# EAGLE design 68008 (EAGLE 7.2.0)
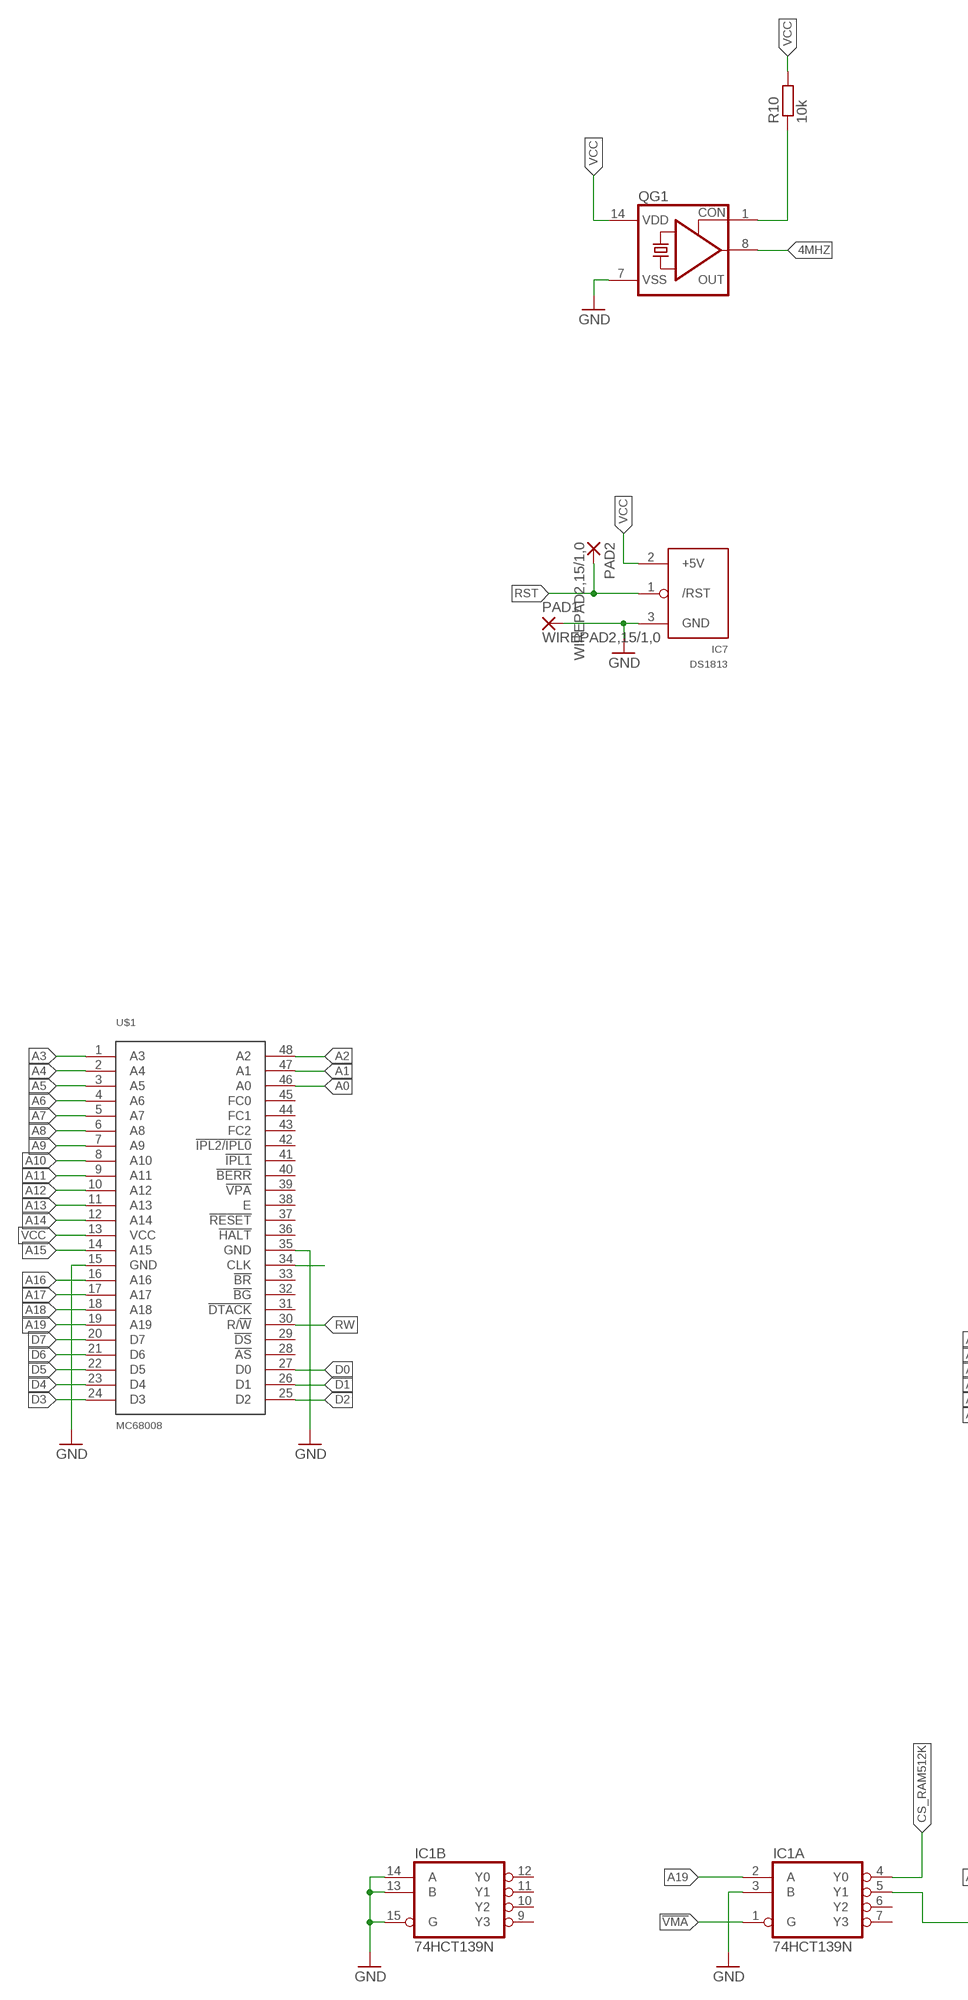
[diagram p0: schematic, sheet 1, part 1 of 2]
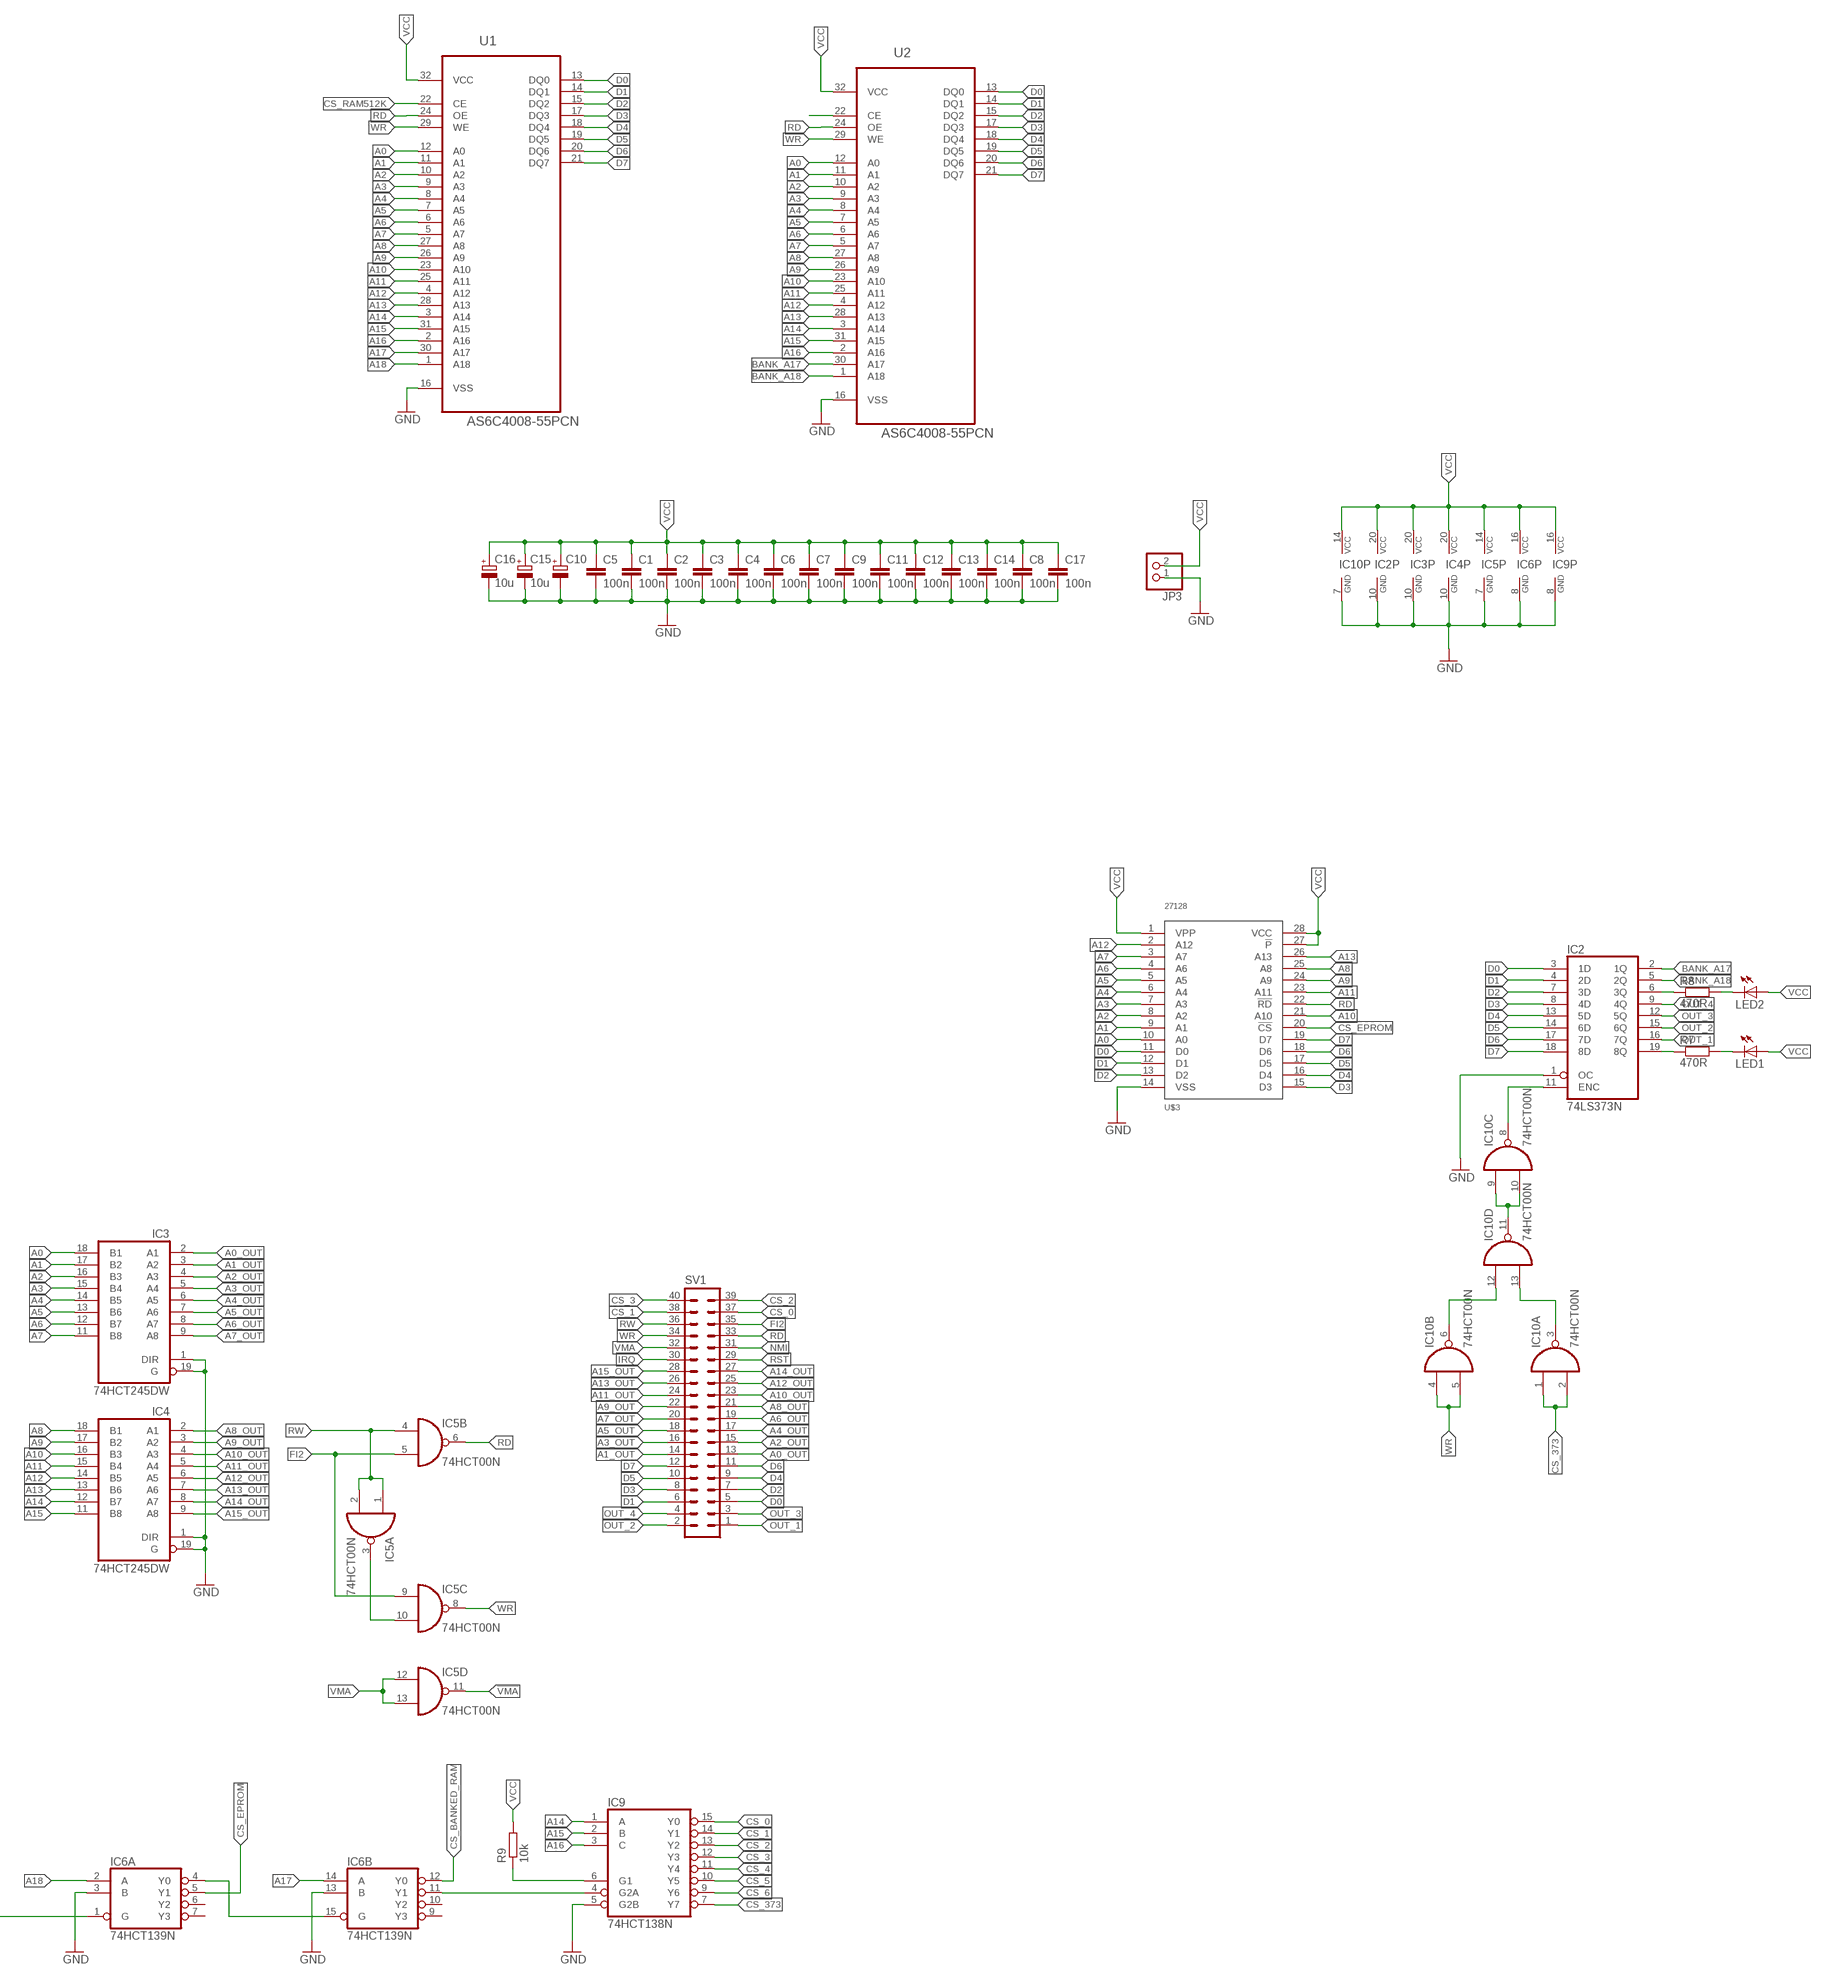
[diagram p1: schematic, sheet 1, part 2 of 2]

## Parts
C1  100n  C-EUC1206  [C1206]
C2  100n  C-EUC1206  [C1206]
C3  100n  C-EUC1206  [C1206]
C4  100n  C-EUC1206  [C1206]
C5  100n  C-EUC0603  [C0603]
C6  100n  C-EUC1206  [C1206]
C7  100n  C-EUC0603  [C0603]
C8  100n  C-EUC1206  [C1206]
C9  100n  C-EUC1206  [C1206]
C10  CPOL-EUE5-10.5  [E5-10,5]
C11  100n  C-EUC0805  [C0805]
C12  100n  C-EUC0805  [C0805]
C13  100n  C-EUC0805  [C0805]
C14  100n  C-EUC0603  [C0603]
C15  10u  CPOL-EUSMCB  [SMC_B]
C16  10u  CPOL-EUSMCB  [SMC_B]
C17  100n  C-EUC0805  [C0805]
IC1  74HCT139N  [DIL16]
IC2  74LS373N  [DIL20]
IC3  74HCT245DW  [SO20W]
IC4  74HCT245DW  [SO20W]
IC5  74HCT00N  [DIL14]
IC6  74HCT139N  [DIL16]
IC7  DS1813  [TO-92]
IC9  74HCT138N  [DIL16]
IC10  74HCT00N  [DIL14]
JP3  PINHD-1X2/90  [1X02/90]
LED1  LED5MM  [LED5MM]
LED2  LED5MM  [LED5MM]
PAD1  WIREPAD2,15/1,0  [2,15/1,0]
PAD2  WIREPAD2,15/1,0  [2,15/1,0]
QG1  CRYSTAL_RES-SG51  [SG51]
R7  470R  R-EU_R1206  [R1206]
R8  470R  R-EU_R1206  [R1206]
R9  10k  R-EU_R1206  [R1206]
R10  10k  R-EU_R1206  [R1206]
SV1  ML40L  [ML40L]
U1  AS6C4008-55PCN  [DIP254P1524X393-32]
U2  AS6C4008-55PCN  [DIP254P1524X393-32]
U$1  MC68008  [DIL48]
U$3  27128  [DIL28]

## Nets
4MHZ: QG1.8(OUT)
!VMA: IC1.1(A:G) IC5.11(D:O)
A0: IC3.18(B1) U1.12(A0) U2.12(A0) U$1.46(A0) U$3.10(A0)
A0_OUT: IC3.2(A1) SV1.13
A1: IC3.17(B2) U1.11(A1) U2.11(A1) U$1.47(A1) U$3.9(A1)
A1_OUT: IC3.3(A2) SV1.14
A2: IC3.16(B3) U1.10(A2) U2.10(A2) U$1.48(A2) U$3.8(A2)
A2_OUT: IC3.4(A3) SV1.15
A3: IC3.15(B4) U1.9(A3) U2.9(A3) U$1.1(A3) U$3.7(A3)
A3_OUT: IC3.5(A4) SV1.16
A4: IC3.14(B5) U1.8(A4) U2.8(A4) U$1.2(A4) U$3.6(A4)
A4_OUT: IC3.6(A5) SV1.17
A5: IC3.13(B6) U1.7(A5) U2.7(A5) U$1.3(A5) U$3.5(A5)
A5_OUT: IC3.7(A6) SV1.18
A6: IC3.12(B7) U1.6(A6) U2.6(A6) U$1.4(A6) U$3.4(A6)
A6_OUT: IC3.8(A7) SV1.19
A7: IC3.11(B8) U1.5(A7) U2.5(A7) U$1.5(A7) U$3.3(A7)
A7_OUT: IC3.9(A8) SV1.20
A8: IC4.18(B1) U1.27(A8) U2.27(A8) U$1.6(A8) U$3.25(A8)
A8_OUT: IC4.2(A1) SV1.21
A9: IC4.17(B2) U1.26(A9) U2.26(A9) U$1.7(A9) U$3.24(A9)
A9_OUT: IC4.3(A2) SV1.22
A10: IC4.16(B3) U1.23(A10) U2.23(A10) U$1.8(A10) U$3.21(A10)
A10_OUT: IC4.4(A3) SV1.23
A11: IC4.15(B4) U1.25(A11) U2.25(A11) U$1.9(A11) U$3.23(A11)
A11_OUT: IC4.5(A4) SV1.24
A12: IC4.14(B5) U1.4(A12) U2.4(A12) U$1.10(A12) U$3.2(A12)
A12_OUT: IC4.6(A5) SV1.25
A13: IC4.13(B6) U1.28(A13) U2.28(A13) U$1.11(A13) U$3.26(A13)
A13_OUT: IC4.7(A6) SV1.26
A14: IC4.12(B7) IC9.1(A) U1.3(A14) U2.3(A14) U$1.12(A14)
A14_OUT: IC4.8(A7) SV1.27
A15: IC4.11(B8) IC9.2(B) U1.31(A15) U2.31(A15) U$1.14(A15)
A15_OUT: IC4.9(A8) SV1.28
A16: IC9.3(C) U1.2(A16) U2.2(A16) U$1.16(A16)
A17: IC6.14(B:A) U1.30(A17) U$1.17(A17)
A18: IC6.2(A:A) U1.1(A18) U$1.18(A18)
A19: IC1.2(A:A) U$1.19(A19)
BANK_A17: IC2.2(1Q) U2.30(A17)
BANK_A18: IC2.5(2Q) U2.1(A18)
CLK: U$1.34(CLK)
CS_0: IC9.15(Y0) SV1.37
CS_1: IC9.14(Y1) SV1.38
CS_2: IC9.13(Y2) SV1.39
CS_3: IC9.12(Y3) SV1.40
CS_4: IC9.11(Y4)
CS_5: IC9.10(Y5)
CS_6: IC9.9(Y6)
CS_373: IC9.7(Y7) IC10.1(A:I0) IC10.2(A:I1)
CS_BANKED_RAM: IC6.12(B:Y0) U2.22(CE)
CS_EPROM: IC6.5(A:Y1) U$3.20(!CS)
CS_RAM512K: IC1.4(A:Y0) U1.22(CE)
D0: IC2.3(1D) SV1.5 U1.13(DQ0) U2.13(DQ0) U$1.27(D0) U$3.11(D0)
D1: IC2.4(2D) SV1.6 U1.14(DQ1) U2.14(DQ1) U$1.26(D1) U$3.12(D1)
D2: IC2.7(3D) SV1.7 U1.15(DQ2) U2.15(DQ2) U$1.25(D2) U$3.13(D2)
D3: IC2.8(4D) SV1.8 U1.17(DQ3) U2.17(DQ3) U$1.24(D3) U$3.15(D3)
D4: IC2.13(5D) SV1.9 U1.18(DQ4) U2.18(DQ4) U$1.23(D4) U$3.16(D4)
D5: IC2.14(6D) SV1.10 U1.19(DQ5) U2.19(DQ5) U$1.22(D5) U$3.17(D5)
D6: IC2.17(7D) SV1.11 U1.20(DQ6) U2.20(DQ6) U$1.21(D6) U$3.18(D6)
D7: IC2.18(8D) SV1.12 U1.21(DQ7) U2.21(DQ7) U$1.20(D7) U$3.19(D7)
FI2: IC5.5(B:I1) IC5.9(C:I0) SV1.35
GND: C1.2 C2.2 C3.2 C4.2 C5.2 C6.2 C7.2 C8.2 C9.2 C10.- C11.2 C12.2 C13.2 C14.2 C15.- C16.- C17.2 IC1.3(A:B) IC1.13(B:B) IC1.14(B:A) IC1.15(B:G) IC2.1(OC) IC2.10(GND) IC3.1(DIR) IC3.10(GND) IC3.19(G) IC4.1(DIR) IC4.10(GND) IC4.19(G) IC5.7(P:GND) IC6.3(A:B) IC6.8(P:GND) IC6.13(B:B) IC7.3(GND) IC9.5(G2B) IC9.8(GND) IC10.7(P:GND) JP3.1 PAD1.1(P) QG1.7(VSS) U1.16(VSS) U2.16(VSS) U$1.15(GND) U$1.35(GND) U$3.14(VSS)
IRQ: SV1.30
N$1: IC1.5(A:Y1) IC6.1(A:G)
N$3: IC2.19(8Q) R7.1
N$4: LED1.K(C) R7.2
N$7: QG1.1(CON) R10.1
N$11: IC2.11(ENC) IC10.8(C:O)
N$12: IC10.9(C:I0) IC10.10(C:I1) IC10.11(D:O)
N$13: IC10.3(A:O) IC10.13(D:I1)
N$14: IC10.6(B:O) IC10.12(D:I0)
N$15: IC2.6(3Q) R8.1
N$17: LED2.K(C) R8.2
N$18: IC5.3(A:O) IC5.10(C:I1)
N$19: IC6.4(A:Y0) IC6.15(B:G)
N$20: IC9.6(G1) R9.1
N$21: IC6.11(B:Y1) IC9.4(G2A)
NMI: SV1.31
OUT_1: IC2.16(7Q) SV1.1
OUT_2: IC2.15(6Q) SV1.2
OUT_3: IC2.12(5Q) SV1.3
OUT_4: IC2.9(4Q) SV1.4
RD: IC5.6(B:O) SV1.33 U1.24(OE) U2.24(OE) U$3.22(!RD)
RST: IC7.1(/RST) PAD2.1(P) SV1.29
RW: IC5.1(A:I0) IC5.2(A:I1) IC5.4(B:I0) SV1.36 U$1.30(R/!W)
VCC: C1.1 C2.1 C3.1 C4.1 C5.1 C6.1 C7.1 C8.1 C9.1 C10.+ C11.1 C12.1 C13.1 C14.1 C15.+ C16.+ C17.1 IC2.20(VCC) IC3.20(VCC) IC4.20(VCC) IC5.14(P:VCC) IC6.16(P:VCC) IC7.2(+5V) IC9.16(VCC) IC10.14(P:VCC) JP3.2 LED1.A LED2.A QG1.14(VDD) R9.2 R10.2 U1.32(VCC) U2.32(VCC) U$1.13(VCC) U$3.1(VPP) U$3.27(!P) U$3.28(VCC)
VMA: IC5.12(D:I0) IC5.13(D:I1) SV1.32
WR: IC5.8(C:O) IC10.4(B:I0) IC10.5(B:I1) SV1.34 U1.29(WE) U2.29(WE)
Unconnected: IC1.6(A:Y2) IC1.7(A:Y3) IC1.9(B:Y3) IC1.10(B:Y2) IC1.11(B:Y1) IC1.12(B:Y0) IC6.6(A:Y2) IC6.7(A:Y3) IC6.9(B:Y3) IC6.10(B:Y2) U$1.28(!AS) U$1.29(!DS) U$1.31(!DTACK) U$1.32(!BG) U$1.33(!BR) U$1.36(!HALT) U$1.37(!RESET) U$1.38(E) U$1.39(!VPA) U$1.40(!BERR) U$1.41(!IPL1) U$1.42(!IPL2/IPL0) U$1.43(FC2) U$1.44(FC1) U$1.45(FC0)

## Power pins joined to a net without a drawn wire
GND: IC1.8(P:GND)
VCC: IC1.16(P:VCC)

## Library data of the parts
C1-C9 C11-C14 C17 = rcl:C-EU: CAPACITOR, European symbol
C10 C15 C16 = rcl:CPOL-EU: POLARIZED CAPACITOR, European symbol
IC1 IC6 = 74xx-eu:74*139: Dual 2-line to 4-line DECODER/DEMULTIPLEXER
IC2 = 74xx-eu:74*373: Octal D type transparent LATCH, edge triggered
IC3 IC4 = 74xx-eu:74*245: Octal BUS TRANSCEIVER, 3-state
IC5 IC10 = 74xx-eu:74*00: Quad 2-input NAND gate
IC7 = ds1813_revised:DS1813
IC9 = 74xx-eu:74*138: 3-line to 8-line DECODER/DEMULTIPLEXER
JP3 = pinhead:PINHD-1X2: PIN HEADER
LED1 LED2 = led:LED: LED OSRAM: - CHIPLED LG R971, LG N971, LY N971, LG Q971, LY Q971, LO R971, LY R971 LH N974, LH R974 LS Q976, LO Q976, LY Q976 LO Q996 - Hyper CHIPLED LW Q18S LB Q993, LB Q99A, LB R99A - SideLED LS A670, LO A670, LY A670, LG A670, LP A670 LB A673, LV A673, LT A673, LW A673 LH A674 LY A675 LS A676, LA A676, LO A676, LY A676, LW A676 LS A679, LY A679, LG A679 - Hyper Micro SIDELED® LS Y876, LA Y876, LO Y876, LY Y876 LT Y87S - SmartLED LW L88C, LW L88S LB L89C, LB L89S, LG L890 LS L89K, LO L89K, LY L89K LS L896, LA L896, LO L896, LY L896 - TOPLED LS T670, LO T670, LY T670, LG T670, LP T670 LSG T670, LSP T670, LSY T670, LOP T670, LYG T670 LG T671, LOG T671, LSG T671 LB T673, LV T673, LT T673, LW T673 LH T674 LS T676, LA T676, LO T676, LY T676, LB T676, LH T676, LSB T676, LW T676 LB T67C, LV T67C, LT T67C, LS T67K, LO T67K, LY T67K, LW E67C LS E67B, LA E67B, LO E67B, LY E67B, LB E67C, LV E67C, LT E67C LW T67C LS T679, LY T679, LG T679 LS T770, LO T770, LY T770, LG T770, LP T770 LB T773, LV T773, LT T773, LW T773 LH T774 LS E675, LA E675, LY E675, LS T675 LS T776, LA T776, LO T776, LY T776, LB T776 LHGB T686 LT T68C, LB T68C - Hyper Mini TOPLED® LB M676 - Mini TOPLED Santana® LG M470 LS M47K, LO M47K, LY M47K Source: http://www.osram.convergy.de LUXEON: - LUMILED® LXK2-PW12-R00, LXK2-PW12-S00, LXK2-PW14-U00, LXK2-PW14-V00 LXK2-PM12-R00, LXK2-PM12-S00, LXK2-PM14-U00 LXK2-PE12-Q00, LXK2-PE12-R00, LXK2-PE12-S00, LXK2-PE14-T00, LXK2-PE14-U00 LXK2-PB12-K00, LXK2-PB12-L00, LXK2-PB12-M00, LXK2-PB14-N00, LXK2-PB14-P00, LXK2-PB14-Q00 LXK2-PR12-L00, LXK2-PR12-M00, LXK2-PR14-Q00, LXK2-PR14-R00 LXK2-PD12-Q00, LXK2-PD12-R00, LXK2-PD12-S00 LXK2-PH12-R00, LXK2-PH12-S00 LXK2-PL12-P00, LXK2-PL12-Q00, LXK2-PL12-R00 Source: www.luxeon.com KINGBRIGHT: KA-3528ASYC Source: www.kingbright.com
PAD1 PAD2 = wirepad:WIREPAD: Wire PAD connect wire on PCB
QG1 = crystal:CRYSTAL_RES-: CRYSTAL RESONATOR; OC_FARNELL: unknown; OC_NEWARK: unknown
R7-R10 = rcl:R-EU_: RESISTOR, European symbol
SV1 = con-harting-ml:ML40: HARTING; OC_FARNELL: unknown; OC_NEWARK: unknown
U1 U2 = Alliance_Memory_By_element14_Batch_1:AS6C4008-55PCN: CMOS SRAM; MPN: AS6C4008-55PCN; OC_FARNELL: 1562900; OC_NEWARK: 94M6217; PACKAGE: DIP-32; SUPPLIER: ALLIANCE MEMORY
U$1 = mw:MC68008
U$3 = mw:27128

## Board
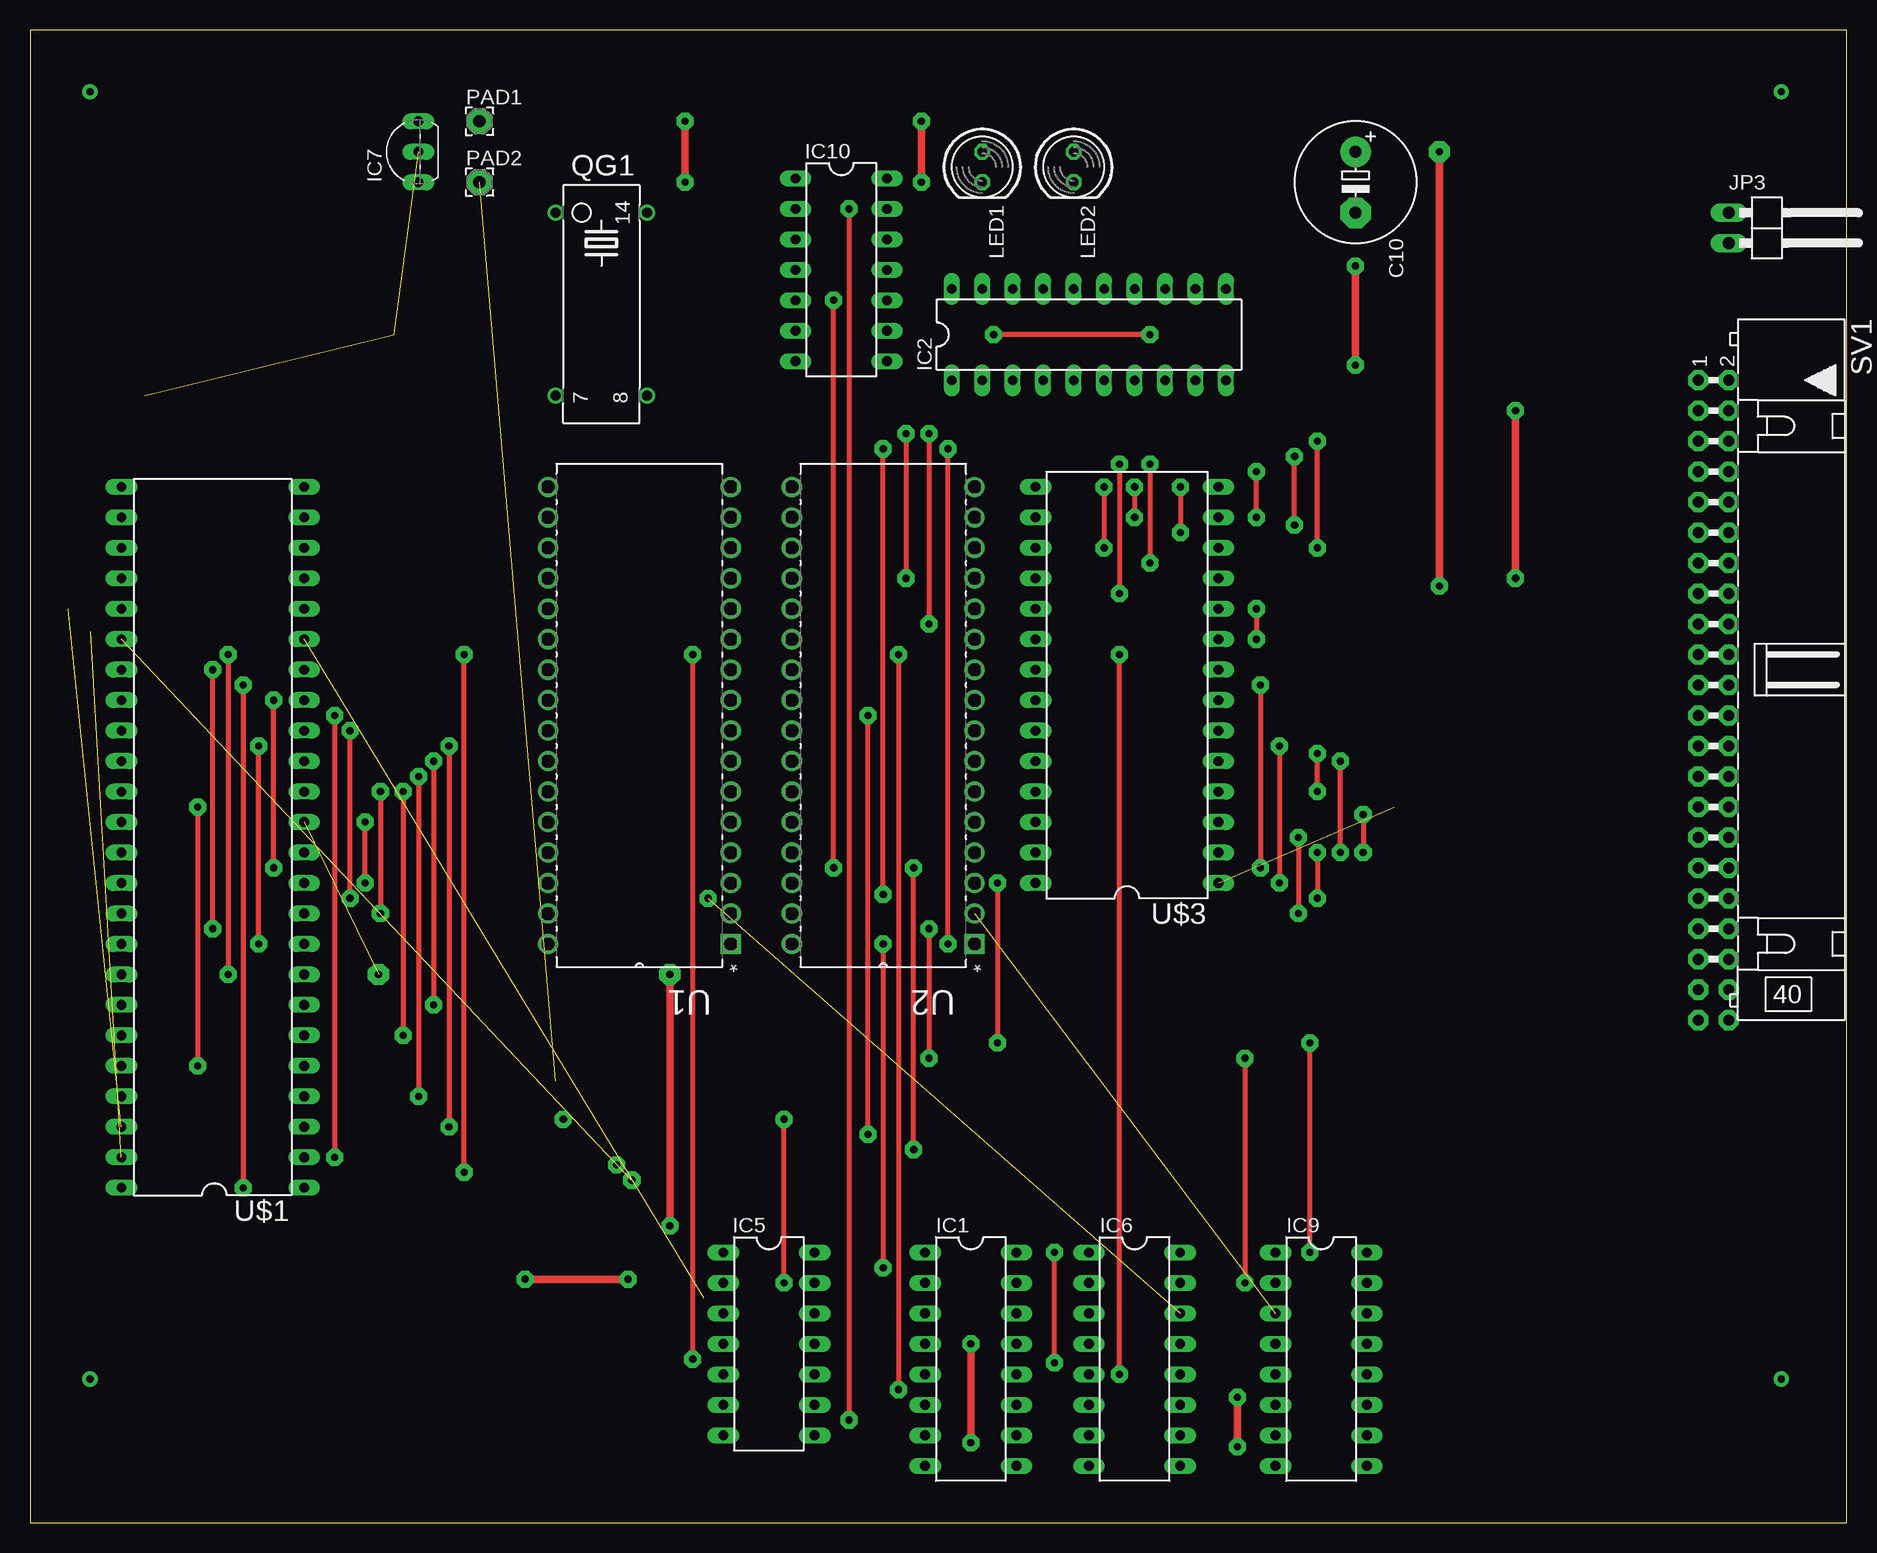
[diagram p2: board, top side]
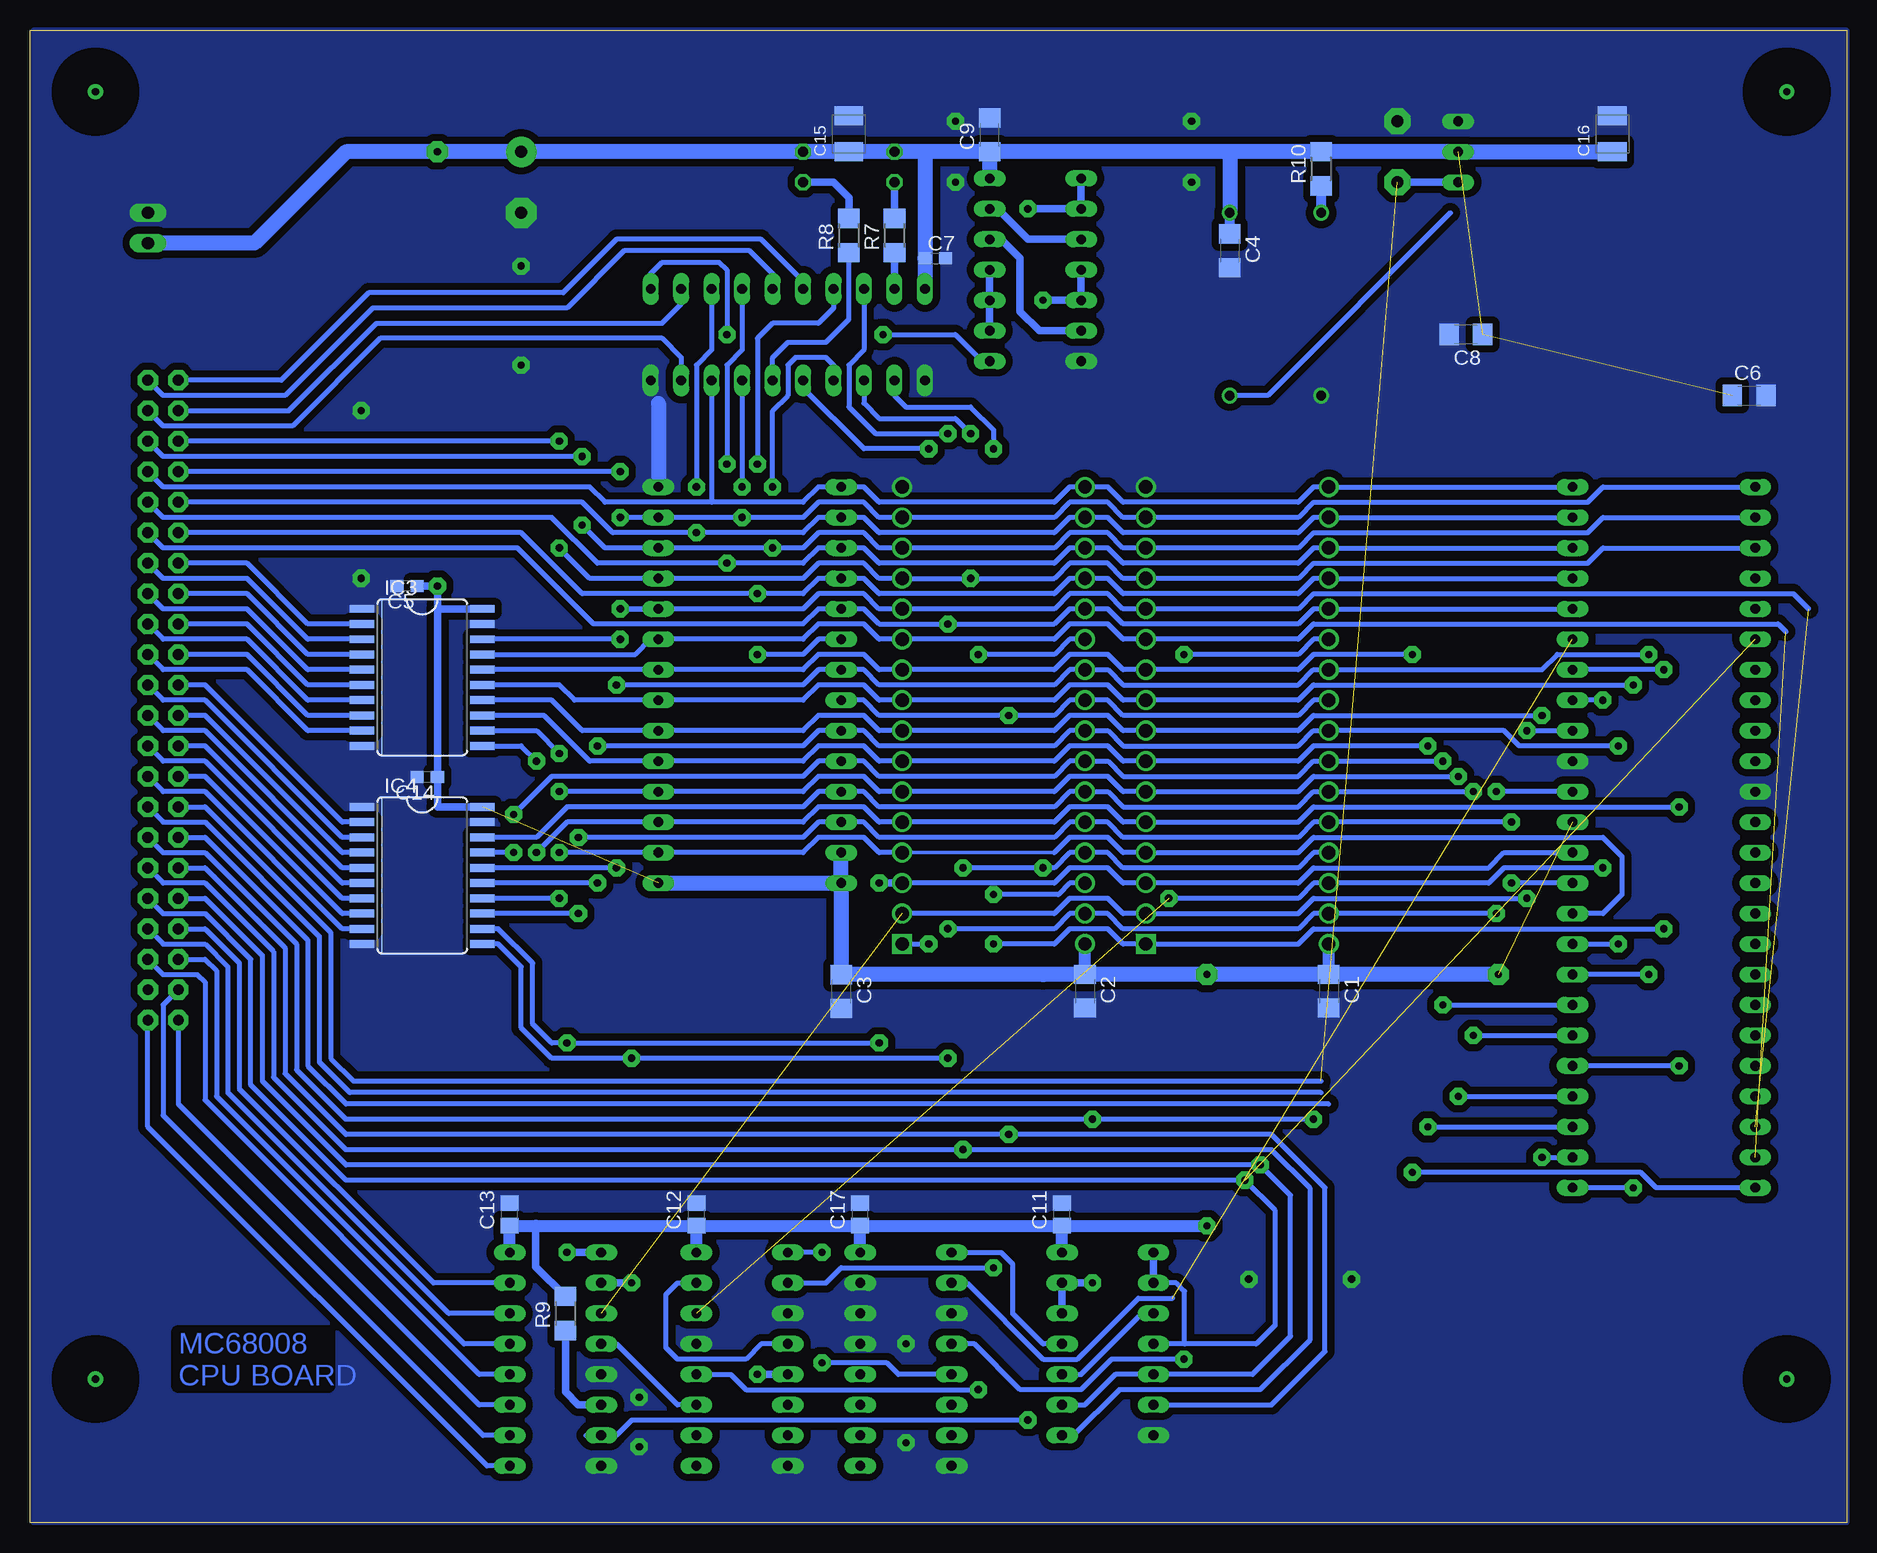
[diagram p3: board, bottom side, seen from below]

Size 151.44 x 124.45 mm. Coordinates in mm from the lower left corner, seen from the top.
Outline: 0,0 151.44,0 151.44,124.45 0,124.45 0,0
Copper layers (1*16): Top 0.035mm / dielectric 1.5mm / Bottom 0.035mm
Design rules "default *": minimum track width 10mil, minimum drill 24mil, track to track 8mil, track to pad 8mil, pad to pad 8mil, via to via 8mil, smd to smd 8mil, copper to edge 0mil, drill to drill 8mil, minimum pad ring 10mil, minimum via ring 8mil, stop-mask expansion 4mil, vias tented up to drill 0mil, thermal gap 10mil
bRestrict: area 2,8.9 to 8,15; area 2,116.3 to 8,122.3; area 142.9,8.9 to 149,15; area 142.9,116.3 to 149,122.3

### Footprints (pad centres in the part's own frame; a part is rotated, then mirrored left to right if it is on the bottom)
C1206 = smd 1.6 x 1.8: 1 -1.4,0; 2 1.4,0
C0603 = smd 1.1 x 1: 1 -0.85,0; 2 0.85,0
E5-10,5 = drill 1.016 pad 2.54: + -2.54,0 | drill 1.016 pad 2.54 octagon: - 2.54,0
C0805 = smd 1.3 x 1.5: 1 -0.95,0; 2 0.95,0
SMC_B = smd 1.6 x 2.4: + -1.5,0; - 1.5,0
DIL16 = drill 0.813 long: 1 -8.89,-3.81; 2 -6.35,-3.81; 3 -3.81,-3.81; 4 -1.27,-3.81; 5 1.27,-3.81; 6 3.81,-3.81; 7 6.35,-3.81; 8 8.89,-3.81; 9 8.89,3.81; 10 6.35,3.81; 11 3.81,3.81; 12 1.27,3.81; 13 -1.27,3.81; 14 -3.81,3.81; 15 -6.35,3.81; 16 -8.89,3.81
DIL20 = drill 0.813 long: 1 -11.43,-3.81; 2 -8.89,-3.81; 3 -6.35,-3.81; 4 -3.81,-3.81; 5 -1.27,-3.81; 6 1.27,-3.81; 7 3.81,-3.81; 8 6.35,-3.81; 9 8.89,-3.81; 10 11.43,-3.81; 11 11.43,3.81; 12 8.89,3.81; 13 6.35,3.81; 14 3.81,3.81; 15 1.27,3.81; 16 -1.27,3.81; 17 -3.81,3.81; 18 -6.35,3.81; 19 -8.89,3.81; 20 -11.43,3.81
SO20W = smd 0.66 x 2.032: 1 -5.715,-5.029; 2 -4.445,-5.029; 3 -3.175,-5.029; 4 -1.905,-5.029; 5 -0.635,-5.029; 6 0.635,-5.029; 7 1.905,-5.029; 8 3.175,-5.029; 9 4.445,-5.029; 10 5.715,-5.029; 11 5.715,5.029; 12 4.445,5.029; 13 3.175,5.029; 14 1.905,5.029; 15 0.635,5.029; 16 -0.635,5.029; 17 -1.905,5.029; 18 -3.175,5.029; 19 -4.445,5.029; 20 -5.715,5.029
DIL14 = drill 0.813 long: 1 -7.62,-3.81; 2 -5.08,-3.81; 3 -2.54,-3.81; 4 0,-3.81; 5 2.54,-3.81; 6 5.08,-3.81; 7 7.62,-3.81; 8 7.62,3.81; 9 5.08,3.81; 10 2.54,3.81; 11 0,3.81; 12 -2.54,3.81; 13 -5.08,3.81; 14 -7.62,3.81
TO-92 = drill 0.813 long: 1 -2.54,0; 2 0,0; 3 2.54,0
1X02/90 = drill 1.016 long: 1 -1.27,-3.81; 2 1.27,-3.81
LED5MM = drill 0.813 octagon: A -1.27,0; K 1.27,0
2,15/1,0 = drill 1.016 pad 2.159 octagon: 1 0,0
SG51 = drill 0.813: 1 -7.62,-3.81; 7 7.62,-3.81; 8 7.62,3.81; 14 -7.62,3.81
R1206 = smd 1.6 x 1.803: 1 -1.422,0; 2 1.422,0
ML40L = drill 0.914 pad 1.676 octagon: 1 -24.13,-1.27; 2 -24.13,1.27; 3 -21.59,-1.27; 4 -21.59,1.27; 5 -19.05,-1.27; 6 -19.05,1.27; 7 -16.51,-1.27; 8 -16.51,1.27; 9 -13.97,-1.27; 10 -13.97,1.27; 11 -11.43,-1.27; 12 -11.43,1.27; 13 -8.89,-1.27; 14 -8.89,1.27; 15 -6.35,-1.27; 16 -6.35,1.27; 17 -3.81,-1.27; 18 -3.81,1.27; 19 -1.27,-1.27; 20 -1.27,1.27; 21 1.27,-1.27; 22 1.27,1.27; 23 3.81,-1.27; 24 3.81,1.27; 25 6.35,-1.27; 26 6.35,1.27; 27 8.89,-1.27; 28 8.89,1.27; 29 11.43,-1.27; 30 11.43,1.27; 31 13.97,-1.27; 32 13.97,1.27; 33 16.51,-1.27; 34 16.51,1.27; 35 19.05,-1.27; 36 19.05,1.27; 37 21.59,-1.27; 38 21.59,1.27; 39 24.13,-1.27; 40 24.13,1.27
DIP254P1524X393-32 = drill 1.118 square: 1 -15.24,38.1 | drill 1.118: 2 -15.24,35.56; 3 -15.24,33.02; 4 -15.24,30.48; 5 -15.24,27.94; 6 -15.24,25.4; 7 -15.24,22.86; 8 -15.24,20.32; 9 -15.24,17.78; 10 -15.24,15.24; 11 -15.24,12.7; 12 -15.24,10.16; 13 -15.24,7.62; 14 -15.24,5.08; 15 -15.24,2.54; 16 -15.24,0; 17 0,0; 18 0,2.54; 19 0,5.08; 20 0,7.62; 21 0,10.16; 22 0,12.7; 23 0,15.24; 24 0,17.78; 25 0,20.32; 26 0,22.86; 27 0,25.4; 28 0,27.94; 29 0,30.48; 30 0,33.02; 31 0,35.56; 32 0,38.1
DIL48 = drill 0.813 long: 1 -29.21,-7.62; 2 -26.67,-7.62; 3 -24.13,-7.62; 4 -21.59,-7.62; 5 -19.05,-7.62; 6 -16.51,-7.62; 7 -13.97,-7.62; 8 -11.43,-7.62; 9 -8.89,-7.62; 10 -6.35,-7.62; 11 -3.81,-7.62; 12 -1.27,-7.62; 13 1.27,-7.62; 14 3.81,-7.62; 15 6.35,-7.62; 16 8.89,-7.62; 17 11.43,-7.62; 18 13.97,-7.62; 19 16.51,-7.62; 20 19.05,-7.62; 21 21.59,-7.62; 22 24.13,-7.62; 23 26.67,-7.62; 24 29.21,-7.62; 25 29.21,7.62; 26 26.67,7.62; 27 24.13,7.62; 28 21.59,7.62; 29 19.05,7.62; 30 16.51,7.62; 31 13.97,7.62; 32 11.43,7.62; 33 8.89,7.62; 34 6.35,7.62; 35 3.81,7.62; 36 1.27,7.62; 37 -1.27,7.62; 38 -3.81,7.62; 39 -6.35,7.62; 40 -8.89,7.62; 41 -11.43,7.62; 42 -13.97,7.62; 43 -16.51,7.62; 44 -19.05,7.62; 45 -21.59,7.62; 46 -24.13,7.62; 47 -26.67,7.62; 48 -29.21,7.62
DIL28 = drill 0.813 long: 1 -16.51,-7.62; 2 -13.97,-7.62; 3 -11.43,-7.62; 4 -8.89,-7.62; 5 -6.35,-7.62; 6 -3.81,-7.62; 7 -1.27,-7.62; 8 1.27,-7.62; 9 3.81,-7.62; 10 6.35,-7.62; 11 8.89,-7.62; 12 11.43,-7.62; 13 13.97,-7.62; 14 16.51,-7.62; 15 16.51,7.62; 16 13.97,7.62; 17 11.43,7.62; 18 8.89,7.62; 19 6.35,7.62; 20 3.81,7.62; 21 1.27,7.62; 22 -1.27,7.62; 23 -3.81,7.62; 24 -6.35,7.62; 25 -8.89,7.62; 26 -11.43,7.62; 27 -13.97,7.62; 28 -16.51,7.62

### Placement (x,y rotation side)
C1  43.18,44.32 270 bottom
C2  63.5,44.32 270 bottom
C3  83.82,44.3 270 bottom
C4  51.44,106.05 270 bottom
C5  120,78.11 180 bottom
C6  8.13,93.98 0 bottom
C7  75.98,105.41 0 bottom
C8  31.75,99.06 180 bottom
C9  71.44,115.71 90 bottom
C10  110.49,111.76 270 top
C11  65.41,25.72 90 bottom
C12  95.89,25.72 90 bottom
C13  111.44,25.72 90 bottom
C14  118.33,62.17 180 bottom
C15  83.19,115.8 90 bottom
C16  19.53,115.8 90 bottom
C17  82.23,25.72 90 bottom
IC1  78.42,13.65 270 top
IC2  88.27,99.06 0 top
IC3  118.75,70.48 270 bottom
IC4  118.75,53.98 270 bottom
IC5  61.59,14.92 270 top
IC6  92.08,13.65 270 top
IC7  32.38,114.3 90 top
IC9  107.63,13.65 270 top
IC10  67.63,104.46 270 top
JP3  145.41,107.95 270 top
LED1  79.38,113.03 270 top
LED2  87,113.03 270 top
PAD1  37.47,116.84 0 top
PAD2  37.47,111.76 0 top
QG1  47.62,101.6 270 top
R7  79.38,107.31 90 bottom
R8  83.19,107.31 90 bottom
R9  106.81,17.46 90 bottom
R10  43.81,112.88 90 bottom
SV1  140.34,71.12 270 top
U1  43.18,86.36 180 top
U2  63.5,86.36 180 top
U$1  15.24,57.15 90 top
U$3  91.44,69.85 90 top

### Tracks (layer width: path | path; a pad name or v marks a point on that pad's centre or on a via)
4MHZ
  Bottom 0.406: 33.02,109.22 48.26,93.98 QG1.8
!VMA
  Bottom 0.406: IC5.11 66.99,14.92 69.53,17.46 69.53,21.59 70.48,22.54 IC1.1
A0  (via drill 0.6 pad 1.42)  (1 unrouted)
  Top 0.406: v102.23,76.2 v102.23,73.66
  Bottom 0.406: U$3.10 v102.23,76.2 87,76.2 85.72,77.47 81.92,77.47 80.64,76.2 U2.12 66.04,76.2 64.77,77.47 61.59,77.47 60.33,76.2 U1.12 45.72,76.2 44.45,77.47 4.45,77.47 3.17,76.2 | v102.23,73.66 IC3.18
A0_OUT
  Bottom 0.406: IC3.2 128.27,74.93 133.35,80.01 SV1.13
A1  (1 unrouted)
  Bottom 0.406: IC3.17 100.97,72.39 99.69,73.66 U$3.9 87,73.66 85.72,74.93 81.92,74.93 80.64,73.66 U2.11 66.04,73.66 64.77,74.93 61.59,74.93 60.33,73.66 U1.11 45.72,73.66 44.45,74.93 5.71,74.93 5.08,74.3
A1_OUT
  Bottom 0.406: IC3.3 128.27,73.66 133.35,78.74 140.34,78.74 SV1.14
A2  (via drill 0.6 pad 1.42)
  Top 0.406: v36.2,29.21 v36.2,72.39
  Bottom 0.406: IC3.16 U$3.8 87,71.12 85.72,72.39 81.92,72.39 80.64,71.12 U2.10 66.04,71.12 64.77,72.39 61.59,72.39 60.33,71.12 U1.10 45.72,71.12 44.45,72.39 v36.2,72.39 | U$1.48 15.88,27.94 17.14,29.21 v36.2,29.21
A2_OUT
  Bottom 0.406: IC3.4 128.27,72.39 133.35,77.47 SV1.15
A3  (via drill 0.6 pad 1.42)
  Top 0.406: v17.78,69.85 v17.78,27.94
  Bottom 0.406: IC3.15 107.31,69.85 106.05,68.58 U$3.7 87,68.58 85.72,69.85 81.92,69.85 80.64,68.58 U2.9 66.04,68.58 64.77,69.85 61.59,69.85 60.33,68.58 U1.9 45.72,68.58 44.45,69.85 v17.78,69.85 | v17.78,27.94 U$1.1
A3_OUT
  Bottom 0.406: IC3.5 128.27,71.12 133.35,76.2 140.34,76.2 SV1.16
A4  (via drill 0.6 pad 1.42)
  Top 0.406: v25.4,67.31 v25.4,30.48
  Bottom 0.406: v25.4,67.31 44.45,67.31 45.72,66.04 U1.8 60.33,66.04 61.59,67.31 64.77,67.31 66.04,66.04 U2.8 80.64,66.04 81.92,67.31 85.72,67.31 87,66.04 U$3.6 105.41,66.04 107.95,68.58 IC3.14 | v25.4,30.48 U$1.2
A4_OUT
  Bottom 0.406: IC3.6 128.27,69.85 133.35,74.93 SV1.17
A5  (via drill 0.6 pad 1.42)
  Top 0.406: v34.92,64.77 v34.92,33.02
  Bottom 0.406: v34.92,64.77 44.45,64.77 45.72,63.5 U1.7 60.33,63.5 61.59,64.77 64.77,64.77 66.04,63.5 U2.7 80.64,63.5 81.92,64.77 85.72,64.77 87,63.5 U$3.5 104.78,63.5 108.58,67.31 IC3.13 | v34.92,33.02 U$1.3
A5_OUT
  Bottom 0.406: IC3.7 128.27,68.58 133.35,73.66 140.34,73.66 SV1.18
A6  (via drill 0.6 pad 1.42)
  Top 0.406: v107.31,60.96 v107.31,64.14 | v32.38,62.23 v32.38,35.56
  Bottom 0.406: v107.31,60.96 U$3.4 87,60.96 85.72,62.23 81.92,62.23 80.64,60.96 U2.6 66.04,60.96 64.77,62.23 61.59,62.23 60.33,60.96 U1.6 45.72,60.96 44.45,62.23 v32.38,62.23 | IC3.12 109.22,66.04 v107.31,64.14 | v32.38,35.56 U$1.4
A6_OUT
  Bottom 0.406: IC3.8 128.27,67.31 133.35,72.39 SV1.19
A7  (via drill 0.6 pad 1.42)
  Top 0.406: v109.22,55.88 v109.22,63.5 | v13.97,59.69 v13.97,38.1
  Bottom 0.406: v109.22,55.88 106.68,58.42 U$3.3 87,58.42 85.72,59.69 81.92,59.69 80.64,58.42 U2.5 66.04,58.42 64.77,59.69 61.59,59.69 60.33,58.42 U1.5 45.72,58.42 44.45,59.69 v13.97,59.69 | IC3.11 110.49,64.77 v109.22,63.5 | v13.97,38.1 U$1.5
A7_OUT
  Bottom 0.406: IC3.9 128.27,66.04 133.35,71.12 140.34,71.12 SV1.20
A8  (via drill 0.6 pad 1.42)
  Top 0.406: v31.11,60.96 v31.11,40.64
  Bottom 0.406: IC4.18 109.22,57.15 106.68,59.69 87,59.69 85.72,60.96 U$3.25 81.92,60.96 80.64,59.69 66.04,59.69 64.77,60.96 U2.27 61.59,60.96 60.33,59.69 45.72,59.69 44.45,60.96 U1.27 v31.11,60.96 | v31.11,40.64 U$1.6
A8_OUT
  Bottom 0.406: IC4.2 125.41,58.42 136.84,69.85 SV1.21
A9  (via drill 0.6 pad 1.42)
  Top 0.406: v111.12,59.05 v111.12,55.88 | v33.66,63.5 v33.66,43.18
  Bottom 0.406: v33.66,63.5 U1.26 44.45,63.5 45.72,62.23 60.33,62.23 61.59,63.5 U2.26 64.77,63.5 66.04,62.23 80.64,62.23 81.92,63.5 U$3.24 85.72,63.5 87,62.23 107.95,62.23 v111.12,59.05 | v111.12,55.88 IC4.17 | v33.66,43.18 U$1.7
A9_OUT
  Bottom 0.406: IC4.3 125.41,57.15 136.84,68.58 140.34,68.58 SV1.22
A10  (via drill 0.6 pad 1.42)
  Top 0.406: v102.55,69.85 v102.55,54.61 | v16.51,72.39 v16.51,45.72
  Bottom 0.406: v102.55,54.61 IC4.16 | v102.55,69.85 87,69.85 85.72,71.12 U$3.21 81.92,71.12 80.64,69.85 66.04,69.85 64.77,71.12 U2.23 61.59,71.12 60.33,69.85 45.72,69.85 44.45,71.12 U1.23 25.4,71.12 24.13,72.39 v16.51,72.39 | v16.51,45.72 U$1.8
A10_OUT
  Bottom 0.406: IC4.4 125.41,55.88 136.84,67.31 SV1.23
A11  (via drill 0.6 pad 1.42)
  Top 0.406: v104.14,64.77 v104.14,53.34 | v19.05,48.26 v19.05,64.77
  Bottom 0.406: v104.14,53.34 IC4.15 | v104.14,64.77 87,64.77 85.72,66.04 U$3.23 81.92,66.04 80.64,64.77 66.04,64.77 64.77,66.04 U2.25 61.59,66.04 60.33,64.77 45.72,64.77 44.45,66.04 U1.25 28.57,66.04 27.3,64.77 v19.05,64.77 | U$1.9 v19.05,48.26
A11_OUT
  Bottom 0.406: IC4.5 125.41,54.61 136.84,66.04 140.34,66.04 SV1.24
A12  (via drill 0.6 pad 1.42)
  Top 0.406: v107.31,55.88 v107.31,52.07
  Bottom 0.305: 66.04,55.88 U2.4
  Bottom 0.406: U2.4 80.64,55.88 81.92,57.15 85.72,57.15 87,55.88 U$3.2 v107.31,55.88 | 66.04,55.88 64.77,57.15 61.59,57.15 60.33,55.88 U1.4 45.72,55.88 44.45,57.15 20.32,57.15 18.73,55.56 18.73,52.39 20.32,50.8 U$1.10 | v107.31,52.07 IC4.14
A12_OUT
  Bottom 0.406: IC4.6 125.41,53.34 136.84,64.77 SV1.25
A13  (via drill 0.6 pad 1.42)
  Top 0.406: v105.73,57.15 v105.73,50.8 | v27.94,53.34 v27.94,58.42
  Bottom 0.406: v105.73,50.8 IC4.13 | v105.73,57.15 87,57.15 85.72,58.42 U$3.26 81.92,58.42 80.64,57.15 66.04,57.15 64.77,58.42 U2.28 61.59,58.42 60.33,57.15 45.72,57.15 44.45,58.42 U1.28 v27.94,58.42 | U$1.11 v27.94,53.34
A13_OUT
  Bottom 0.406: IC4.7 125.41,52.07 136.84,63.5 140.34,63.5 SV1.26
A14  (via drill 0.6 pad 1.42)
  Top 0.406: v80.64,53.34 v80.64,40.01 | v106.68,22.54 v106.68,40.01
  Bottom 0.406: IC4.12 112.39,49.53 109.54,46.67 109.54,41.59 107.95,40.01 v106.68,40.01 v80.64,40.01 | U2.3 66.04,53.34 64.77,54.61 61.59,54.61 60.33,53.34 U1.3 45.72,53.34 44.45,54.61 29.84,54.61 28.57,55.88 U$1.12
  Bottom 0.61: v106.68,22.54 IC9.1 | v80.64,53.34 U2.3
A14_OUT
  Bottom 0.406: IC4.8 125.41,50.8 136.84,62.23 SV1.27
A15  (via drill 0.6 pad 1.42)
  Top 0.406: v101.28,38.73 v101.28,20 | v74.93,49.53 v74.93,38.73 | v29.21,60.96 v29.21,50.8
  Bottom 0.406: IC4.11 112.39,48.26 110.49,46.35 110.49,41.27 107.95,38.73 v101.28,38.73 v74.93,38.73 | v74.93,49.53 66.04,49.53 64.77,50.8 U2.31 61.59,50.8 60.33,49.53 45.72,49.53 44.45,50.8 U1.31 v29.21,50.8 | U$1.14 v29.21,60.96
  Bottom 0.61: v101.28,20 IC9.2
A15_OUT
  Bottom 0.406: IC4.9 125.41,49.53 136.84,60.96 140.34,60.96 SV1.28
A16  (via drill 0.6 pad 1.42)  (1 unrouted)
  Top 0.406: v26.67,52.07 v26.67,66.04
  Bottom 0.406: U2.2 66.04,50.8 64.77,52.07 61.59,52.07 60.33,50.8 U1.2 45.72,50.8 44.45,52.07 v26.67,52.07 | v26.67,66.04 U$1.16
A17  (via drill 0.6 pad 1.42)  (1 unrouted)
  Top 0.406: v20.32,54.61 v20.32,68.58
  Bottom 0.406: v56.52,52.07 45.72,52.07 44.45,53.34 U1.30 29.84,53.34 28.57,54.61 v20.32,54.61 | v20.32,68.58 U$1.17
A18  (via drill 0.6 pad 1.42)
  Top 0.406: v71.12,48.26 v71.12,21.27 | v15.24,49.53 v15.24,71.12
  Bottom 0.406: IC6.2 85.09,20 83.82,21.27 v71.12,21.27 | v71.12,48.26 66.04,48.26 64.77,49.53 61.59,49.53 60.33,48.26 U1.1 45.72,48.26 44.45,49.53 v15.24,49.53 | v15.24,71.12 U$1.18
A19  (1 unrouted)
  Bottom 0.406: IC1.2 73.34,20 66.99,13.65 64.14,13.65 59.05,18.73 56.2,18.73
BANK_A17  (via drill 0.6 pad 1.42)
  Top 0.406: v71.12,52.39 v71.12,89.53
  Bottom 0.406: U2.30 64.77,53.34 65.72,52.39 v71.12,52.39 | IC2.2 79.38,93.98 78.42,93.03 73.03,93.03 71.12,91.12 v71.12,89.53
BANK_A18  (via drill 0.6 pad 1.42)
  Top 0.406: v76.52,48.26 v76.52,89.53
  Bottom 0.406: U2.1 v76.52,48.26 | v76.52,89.53 81.92,89.53 87,94.61 IC2.5
CS_0
  Bottom 0.406: SV1.37 136.84,49.53 133.99,46.67 133.99,36.2 117.79,20 IC9.15
CS_1
  Bottom 0.406: SV1.38 140.34,48.26 136.84,48.26 134.94,46.35 134.94,35.88 116.52,17.46 IC9.14
CS_2
  Bottom 0.406: SV1.39 136.84,46.99 135.89,46.04 135.89,35.56 115.25,14.92 IC9.13
CS_3
  Bottom 0.406: SV1.40 140.34,45.72 137.48,45.72 136.84,45.09 136.84,35.24 113.98,12.38 IC9.12
CS_4  (via drill 0.9 pad 1.68)
  Bottom 0.406: v139.06,41.91 139.06,34.93 113.98,9.84 IC9.11
CS_5  (via drill 0.9 pad 1.68)
  Bottom 0.406: v139.06,44.45 140.34,43.18 140.34,33.97 113.67,7.3 IC9.10
CS_6  (via drill 0.9 pad 1.68)
  Bottom 0.406: v141.6,41.91 141.6,33.02 113.35,4.76 IC9.9
CS_373  (via drill 0.6 pad 1.42)
  Top 0.406: v68.26,109.54 v68.26,8.57
  Bottom 0.406: 105.09,7.3 IC9.7 102.55,7.3 101.28,8.57 v68.26,8.57
  Bottom 0.61: IC10.1 IC10.2 v68.26,109.54
CS_BANKED_RAM  (via drill 0.6 pad 1.42)
  Top 0.406: v72.39,72.39 v72.39,11.11
  Bottom 0.406: U2.22 64.77,73.66 66.04,72.39 v72.39,72.39 | IC6.12 93.03,12.38 91.76,11.11 v72.39,11.11
CS_EPROM  (via drill 0.6 pad 1.42)
  Top 0.406: v90.81,12.38 v90.81,72.39
  Bottom 0.406: U$3.20 85.72,73.66 87,72.39 v90.81,72.39
  Bottom 0.61: IC6.5 v90.81,12.38
CS_RAM512K  (via drill 0.6 pad 1.42)
  Top 0.406: v55.24,72.39 v55.24,13.65
  Bottom 0.406: U1.22 44.45,73.66 45.72,72.39 v55.24,72.39 | v55.24,13.65 61.28,13.65 63.82,11.11 68.9,11.11 72.71,14.92 IC1.4
D0  (via drill 0.6 pad 1.42)
  Top 0.406: v73.03,90.8 v73.03,78.74 | v107.31,81.28 v107.31,90.17
  Bottom 0.406: IC2.3 81.92,93.34 80.64,92.08 74.3,92.08 v73.03,90.8 | v107.31,81.28 104.78,78.74 U$3.11 87,78.74 85.72,80.01 81.92,80.01 80.64,78.74 U2.13 v73.03,78.74 66.04,78.74 64.77,80.01 61.59,80.01 60.33,78.74 U1.13 45.72,78.74 44.45,80.01 21.59,80.01 20.32,81.28 U$1.27 | v107.31,90.17 SV1.5
D1  (via drill 0.6 pad 1.42)
  Top 0.406: v89.53,86.36 v89.53,81.28 | v105.41,83.19 v105.41,88.9
  Bottom 0.406: IC2.4 84.45,96.52 85.09,97.16 87.63,97.16 88.27,96.52 88.27,93.98 89.53,92.71 v89.53,86.36 | v105.41,83.19 103.5,81.28 U$3.12 v89.53,81.28 87,81.28 85.72,82.55 81.92,82.55 80.64,81.28 U2.14 66.04,81.28 64.77,82.55 61.59,82.55 60.33,81.28 U1.14 45.72,81.28 44.45,82.55 21.59,82.55 20.32,83.82 U$1.26 | v105.41,88.9 140.34,88.9 SV1.6
D2  (via drill 0.6 pad 1.42)
  Top 0.406: v92.08,86.36 v92.08,83.82 | v102.23,83.82 v102.23,87.63
  Bottom 0.406: v102.23,83.82 U$3.13 v92.08,83.82 87,83.82 85.72,85.09 81.92,85.09 80.64,83.82 U2.15 66.04,83.82 64.77,85.09 61.59,85.09 60.33,83.82 U1.15 45.72,83.82 44.45,85.09 21.59,85.09 20.32,86.36 U$1.25 | IC2.7 v92.08,86.36 | v102.23,87.63 SV1.7
D3
  Bottom 0.406: 94.61,85.09 87,85.09 85.72,86.36 U$3.15 81.92,86.36 80.64,85.09 66.04,85.09 64.77,86.36 U2.17 61.59,86.36 60.33,85.09 45.72,85.09 44.45,86.36 U1.17 U$1.24 | 94.61,85.09 103.5,85.09 104.78,86.36 140.34,86.36 SV1.8 | IC2.8 94.61,85.09
D4  (via drill 0.6 pad 1.42)
  Top 0.406: v95.89,86.36 v95.89,82.55
  Bottom 0.406: IC2.13 94.61,97.79 95.89,96.52 v95.89,86.36 | SV1.9 105.41,85.09 102.87,82.55 v95.89,82.55 87,82.55 85.72,83.82 U$3.16 81.92,83.82 80.64,82.55 66.04,82.55 64.77,83.82 U2.18 61.59,83.82 60.33,82.55 45.72,82.55 44.45,83.82 U1.18 U$1.23
D5  (via drill 0.6 pad 1.42)
  Top 0.406: v93.34,88.27 v93.34,80.01
  Bottom 0.406: IC2.14 92.08,97.79 93.34,96.52 v93.34,88.27 | SV1.10 140.34,83.82 107.95,83.82 104.14,80.01 v93.34,80.01 87,80.01 85.72,81.28 U$3.17 81.92,81.28 80.64,80.01 66.04,80.01 64.77,81.28 U2.19 61.59,81.28 60.33,80.01 45.72,80.01 44.45,81.28 U1.19 U$1.22
D6  (via drill 0.6 pad 1.42)
  Top 0.406: v90.81,88.27 v90.81,77.47
  Bottom 0.406: IC2.17 84.45,101.28 85.72,100.01 89.53,100.01 90.81,98.74 v90.81,88.27 | SV1.11 110.49,82.55 105.41,77.47 v90.81,77.47 87,77.47 85.72,78.74 U$3.18 81.92,78.74 80.64,77.47 66.04,77.47 64.77,78.74 U2.20 61.59,78.74 60.33,77.47 45.72,77.47 44.45,78.74 U1.20 U$1.21
D7  (via drill 0.6 pad 1.42)
  Top 0.406: v74.93,90.8 v74.93,74.93
  Bottom 0.406: IC2.18 81.92,97.79 83.19,96.52 83.19,93.03 80.96,90.8 v74.93,90.8 | SV1.12 140.34,81.28 110.81,81.28 104.46,74.93 87,74.93 85.72,76.2 U$3.19 81.92,76.2 80.64,74.93 v74.93,74.93 66.04,74.93 64.77,76.2 U2.21 61.59,76.2 60.33,74.93 45.72,74.93 44.45,76.2 U1.21 U$1.20
FI2  (via drill 0.6 pad 1.42)
  Bottom 0.406: IC5.9 63.5,9.84 60.96,12.38 IC5.5 49.53,12.38 46.35,15.56 46.35,27.3 v48.9,29.84 125.09,29.84 132.08,36.83 132.08,47.31 136.84,52.07 SV1.35
GND  (via drill 0.6 pad 1.42)
  Top 0.61: v54.61,111.76 v54.61,116.84 | v74.3,116.84 v74.3,111.76 | v110.49,104.78 v110.49,96.52 | v123.83,92.71 v123.83,78.74 | v41.27,20.32 v49.85,20.32 | v100.65,10.48 v100.65,6.35 | v78.42,14.92 v78.42,6.67
  Bottom 1.016: 83.72,42.95 C3.2 83.8,42.92
  Bottom 1.27: 99.06,93.34 U$3.14
  pour Bottom (isolate 0.61, no thermals): 0,124.46 0,0 151.13,0 151.13,124.46
IRQ
  Bottom 0.406: 43.81,35.88 124.78,35.88 127.32,38.42 127.32,48.89 136.84,58.42 140.34,58.42 SV1.30
N$1  (via drill 0.6 pad 1.42)
  Top 0.406: v85.41,13.34 v85.41,22.54
  Bottom 0.406: IC1.5 79.06,12.38 80.01,13.34 v85.41,13.34 | v85.41,22.54 IC6.1
N$2  (via drill 0.9 pad 1.68)
  other vias: 141.6,44.45
N$3
  Bottom 0.61: IC2.19 R7.1
N$4
  Bottom 0.61: R7.2 LED1.K
N$7
  Bottom 0.813: R10.1 QG1.1
N$11  (via drill 0.6 pad 1.42)
  Top 0.406: v93.34,99.06 v80.33,99.06
  Bottom 0.406: IC2.11 99.69,104.14 98.74,105.09 93.98,105.09 93.34,104.46 v93.34,99.06 | v80.33,99.06 74.3,99.06 72.07,96.84 IC10.8
N$12
  Bottom 0.61: IC10.9 IC10.10 IC10.11
N$13
  Bottom 0.61: IC10.3 68.26,107 70.8,109.54 IC10.13
N$14
  Bottom 0.61: IC10.6 67.31,99.38 68.9,100.97 68.9,105.41 70.48,107 IC10.12
N$15
  Bottom 0.406: IC2.6 89.53,97.16 88.27,98.42 85.09,98.42 83.19,100.33 R8.1
N$17
  Bottom 0.61: LED2.K 84.45,111.76 83.19,110.49 R8.2
N$18
  Bottom 0.406: IC5.10 63.82,12.38 58.74,17.46 IC5.3
N$19
  Bottom 0.406: IC6.4 90.49,14.92 91.76,13.65 97.47,13.65 98.42,14.61 98.42,19.05 97.47,20 IC6.15
N$20
  Bottom 0.61: R9.1 106.81,10.92 105.73,9.84 IC9.6
N$21
  Bottom 0.406: IC6.11 97.47,9.84 102.55,14.92 IC9.4
N$23  (via drill 0.6 pad 1.27)
  other vias: 5,119.3
N$24  (via drill 0.6 pad 1.27)
  other vias: 145.97,11.98
N$25  (via drill 0.6 pad 1.27)
  other vias: 145.97,119.3
N$37  (via drill 0.6 pad 1.27)
  other vias: 5,11.98
NMI
  Bottom 0.406: SV1.31 136.84,57.15 128.27,48.58 128.27,38.1 125.09,34.93 43.18,34.93
OUT_1
  Bottom 0.406: IC2.16 87,103.5 90.49,107 102.55,107 107,102.55 123.19,102.55 130.49,95.25 SV1.1
OUT_2
  Bottom 0.406: IC2.15 89.53,104.14 91.44,106.05 101.92,106.05 106.68,101.28 122.87,101.28 130.18,93.98 140.34,93.98 SV1.2
OUT_3
  Bottom 0.406: SV1.3 129.86,92.71 122.56,100.01 98.74,100.01 97.16,101.6 IC2.12
OUT_4
  Bottom 0.406: 97.16,95.89 IC2.9 97.16,97.16 98.74,98.74 122.24,98.74 129.54,91.44 140.34,91.44 SV1.4
RD  (via drill 0.6 pad 1.42)
  Top 0.406: v69.85,32.38 v69.85,67.31
  Bottom 0.406: U1.24 44.45,68.58 45.72,67.31 60.33,67.31 61.59,68.58 U2.24 64.77,68.58 66.04,67.31 v69.85,67.31 80.64,67.31 81.92,68.58 U$3.22 | IC5.6 47.94,9.84 43.5,14.29 43.5,27.94 47.94,32.38 v69.85,32.38 125.09,32.38 130.18,37.47 130.18,47.94 136.84,54.61 SV1.33
RST  (1 unrouted)
  Bottom 0.406: 43.81,36.83 124.46,36.83 126.36,38.73 126.36,49.21 136.84,59.69 SV1.29
  Bottom 0.61: IC7.1 PAD2.1
RW  (via drill 0.6 pad 1.42)  (1 unrouted)
  Bottom 0.406: 58.74,14.92 IC5.4 55.2,14.92 | SV1.36 140.34,50.8 136.84,50.8 133.03,46.99 133.03,36.51 125.09,28.57 v50.16,28.57 47.62,26.04 47.62,16.51 49.21,14.92 55.2,14.92 | 55.2,14.92 55.2,19.32 55.88,20 IC5.2
  Bottom 0.61: IC5.1 IC5.2
VCC  (via drill 0.6 pad 1.42, 0.6 pad 1.78)  (4 unrouted)
  Top 0.61: v53.34,45.72 v53.34,24.77 | v117.47,78.11 v117.47,114.3
  Bottom 0.406: C12.1 | C11.1 65.09,24.77 | C13.1 | C14.1 117.48,62.23 117.47,62.23 | C7.1 | C16.+ 19.68,114.3 | R10.2
  Bottom 0.61: 117.47,76.2 v117.47,78.11 C5.1 | 117.47,76.2 117.47,62.23 117.47,59.69 IC4.20 | C15.+ | IC3.20 117.47,76.2 | 109.27,24.77 109.27,21.35 R9.2
  Bottom 0.813: C4.1 QG1.14
  Bottom 1.016: 83.8,45.72 C3.1 | C12.1 109.27,24.77 C13.1 IC9.16 | C12.1 C17.1 | C17.1 C11.1 IC5.14 | 65.09,24.77 v53.34,24.77 | IC1.16 C17.1 | IC6.16 C12.1 | C1.1 U1.32 | C2.1 U2.32
  Bottom 1.27: U$3.28 C3.1 83.8,45.72 66.99,45.72 C2.1 | U$3.28 U$3.27 | U$3.1 U$3.28 | C6.1 | 51.44,114.3 R10.2 IC7.2 19.68,114.3 C16.+ | 51.44,114.3 QG1.14 | 51.44,114.3 71.12,114.3 | 71.12,114.3 76.83,114.3 | 76.83,114.3 C7.1 | 76.83,114.3 LED1.A C15.+ LED2.A C10.+ v117.47,114.3 125.09,114.3 132.72,106.68 JP3.2 | C2.1 | IC10.14 C9.1 71.13,114.31 71.12,114.3 | C7.1 IC2.20 | C1.1 | v29.04,45.72 C1.1 | C1.1 48.26,45.72 v53.34,45.72 C2.1
VMA  (via drill 0.6 pad 1.42)
  Top 0.406: v62.87,20 v62.87,33.66
  Bottom 0.406: SV1.32 140.34,55.88 136.84,55.88 129.22,48.26 129.22,37.78 125.09,33.66 v62.87,33.66 v44.45,33.66
  Bottom 0.61: v62.87,20 IC5.13 IC5.12
WR  (via drill 0.6 pad 1.42)
  Top 0.406: v73.66,31.11 v73.66,54.61 | v66.99,54.61 v66.99,101.92
  Bottom 0.406: U1.29 44.45,55.88 45.72,54.61 60.33,54.61 61.59,55.88 U2.29 64.77,55.88 66.04,54.61 v66.99,54.61 v73.66,54.61 | IC5.8 64.45,7.3 60.64,11.11 48.9,11.11 44.77,15.24 44.77,27.94 47.94,31.11 v73.66,31.11 125.09,31.11 131.13,37.15 131.13,47.62 136.84,53.34 140.34,53.34 SV1.34
  Bottom 0.61: v66.99,101.92 IC10.5 IC10.4

### Text on the board
Bottom: MC68008 / CPU BOARD